# Altium schematic sheet voltage_regulators.SchDoc
size A; SheetNumber: 4; SheetTotal: 4
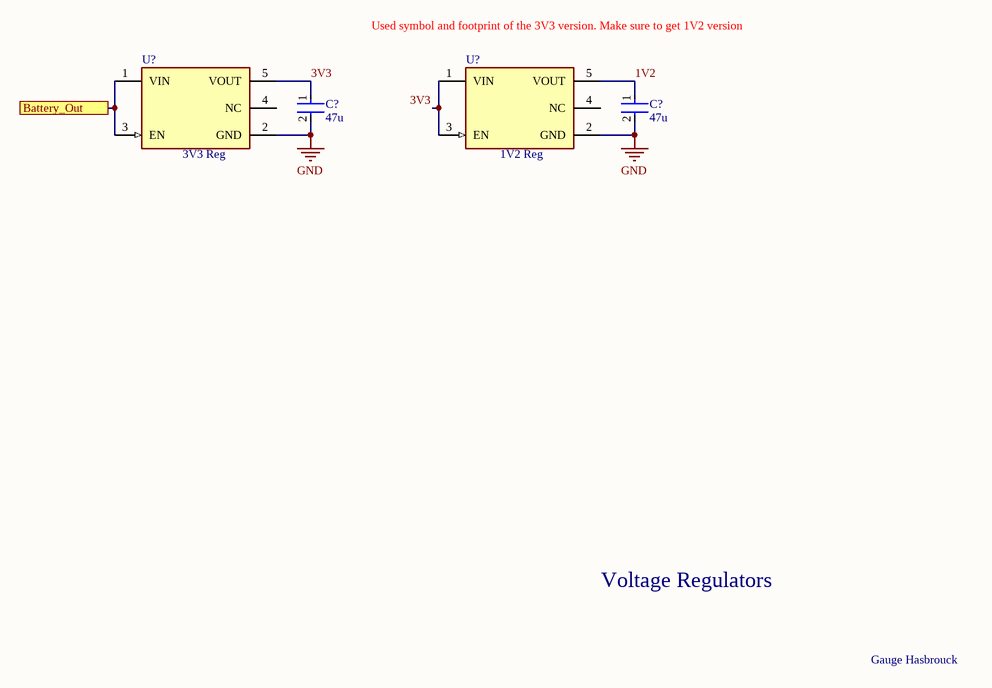
[diagram p0: voltage_regulators.SchDoc]

## Parts
(Parts that share a designator on the sheet are numbered #1, #2 ... from top to bottom, then left to right.)
C?#1  47u  [FP-GRM21B-0_2-MFG]
C?#2  47u  [FP-GRM21B-0_2-MFG]
U?#1  3V3 Reg  [FP-SOT25-IPC_A]
U?#2  1V2 Reg  [FP-SOT25-IPC_A]

## Ports
Battery_Out

## Nets
GND: C?#1.2 C?#2.2 U?#1.2(GND) U?#2.2(GND)
1V2: C?#2.1 U?#2.5(VOUT)
3V3: C?#1.1 U?#1.5(VOUT) U?#2.1(VIN) U?#2.3(EN)
Battery_Out: U?#1.1(VIN) U?#1.3(EN) ; port Battery_Out

Not connected (* = marked no-connect by the designer): U?#1 4(NC); U?#2 4(NC)

## Notes on the sheet
- Used symbol and footprint of the 3V3 version. Make sure to get 1V2 version
- Voltage Regulators
- Gauge Hasbrouck

## Library data of the parts
C?#1 C?#2 = CMP-2007-03221-2: CAP CER 47UF 6.3V X5R 0805; Tolerance: 20%; Min Operating Temperature: -55°C; Depth: 1.25mm; Thickness: 0.057inch; RoHS Compliant: Yes; Dielectric: X5R; Voltage Rating: 6.3V; Case/Package: 0805; Height: 1.25mm; Package Quantity: 3000; Case Code (Metric): 2012; Termination: SMD/SMT; Packaging: Tape and Reel; Voltage Rating (DC): 6.3V; Weight: 0.000335oz; Width: 0.049inch; Capacitance: 47uF; Length: 2mm; Lead Free: Lead Free; Max Operating Temperature: 85°C; Voltage: 6.3V; REACH SVHC: No SVHC; Mount: Surface Mount; Case Code (Imperial): 0805
U?#1 U?#2 = CMP-12756-000035-1: IC REG LINEAR 3.3V 600MA SOT25; Number of Regulators: 1; Output Type: Fixed; Polarity: Positive; Min Input Voltage: 2.5V; Max Input Voltage: 6V; Accuracy: 1.5%; Quiescent Current: 55uA; Dropout Voltage: 250mV; Min Operating Temperature: -40°C; Length: 3.1mm; Output Current: 600mA; Max Operating Temperature: 85°C; Package Quantity: 1; Output Voltage: 3.3V; Width: 1.7mm; Number of Outputs: 1; Packaging: Tape and Reel; Height: 1.3mm; Lead Free: Lead Free; Max Output Current: 600mA; Case/Package: SOT-23-5; Mount: Surface Mount; Number of Pins: 5